# Altium schematic sheet USB-ESP32.SchDoc
size B
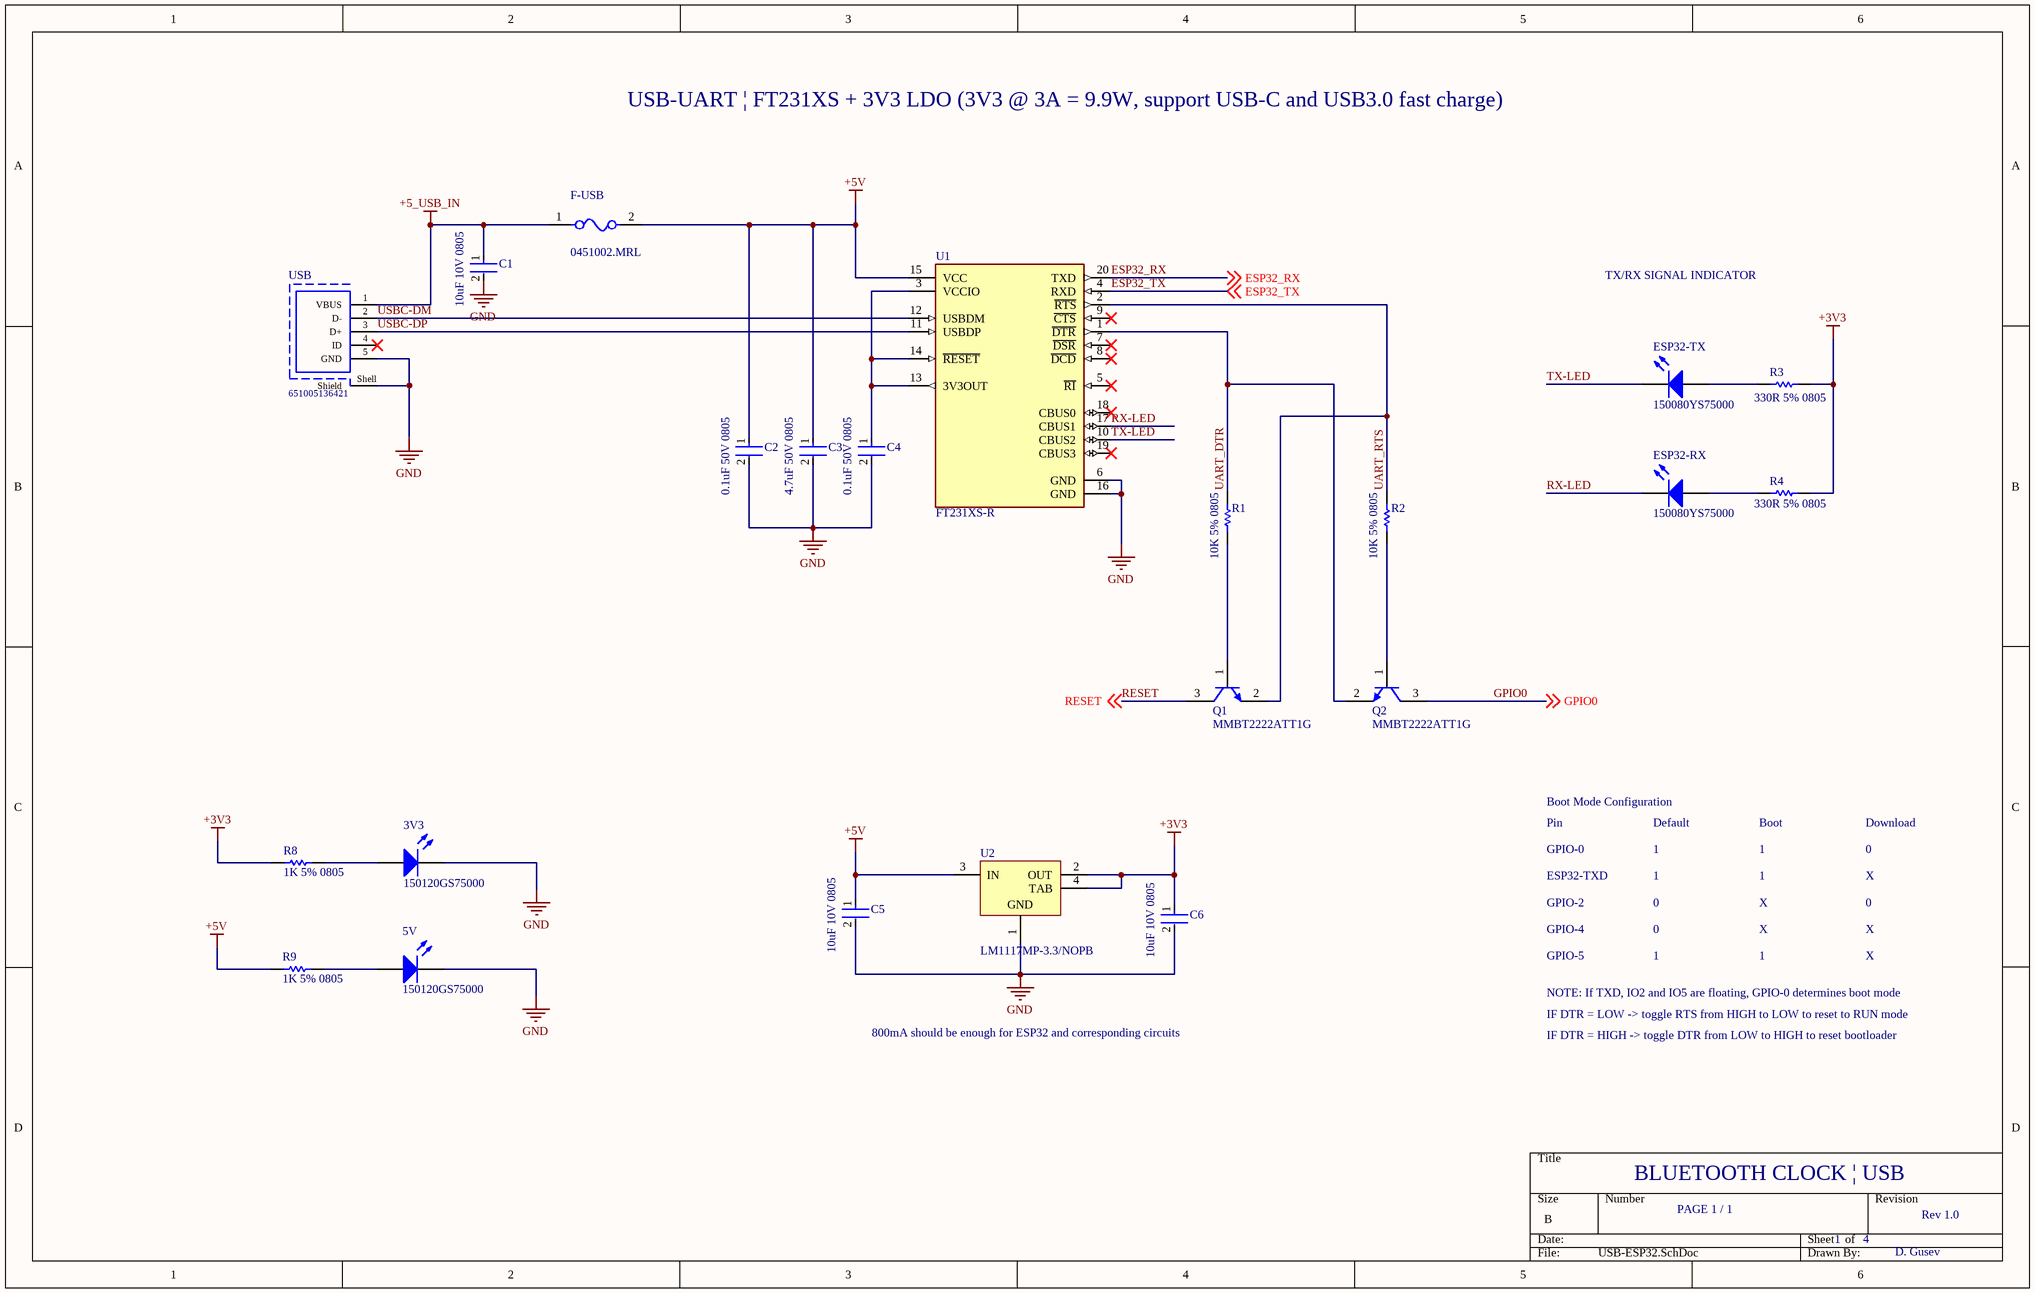
[diagram p0: USB-ESP32.SchDoc]

## Parts
3V3  150120GS75000  [1206_A]
5V  150120GS75000  [1206_A]
C1  10uF 10V 0805  [FP-C0805C-DG-MFG]
C2  0.1uF 50V 0805  [FP-C0805C-DN-MFG]
C3  4.7uF 50V 0805  [FP-C2012-125-MFG]
C4  0.1uF 50V 0805  [FP-C0805C-DN-MFG]
C5  10uF 10V 0805  [FP-C0805C-DG-MFG]
C6  10uF 10V 0805  [FP-C0805C-DG-MFG]
ESP32-RX  150080YS75000  [0805_A]
ESP32-TX  150080YS75000  [0805_A]
F-USB  0451002.MRL  [FP-0451-MFG]
Q1  MMBT2222ATT1G  [ONSC-SC-75-3-463-01_V]
Q2  MMBT2222ATT1G  [ONSC-SC-75-3-463-01_V]
R1  10K 5% 0805  [RESC2013X60X40ML20T25]
R2  10K 5% 0805  [RESC2013X60X40ML20T25]
R3  330R 5% 0805  [RESC2013X60X40ML20T25]
R4  330R 5% 0805  [RESC2013X60X40ML20T25]
R8  1K 5% 0805  [RESC2013X60X40ML20T25]
R9  1K 5% 0805  [RESC2013X60X40ML20T25]
U1  FT231XS-R  [FP-SSOP-20-MFG]
U2  LM1117MP-3.3/NOPB  [DCY0004A_L]
USB  651005136421  [651005136421]

## Nets
+3V3: C6.1 R3.1 R4.1 R8.2 U2.2(OUT) U2.4(TAB)
+5_USB_IN: C1.1 F-USB.1 USB.1(VBUS)
+5V: C2.1 C3.1 C5.1 F-USB.2 R9.2 U1.15(VCC) U2.3(IN)
GND: 3V3.1(K) 5V.1(K) C1.2 C2.2 C3.2 C4.2 C5.2 C6.2 U1.6(GND) U1.16(GND) U2.1(GND) USB.5(GND) USB.Shell(Shield)
ESP32_RX: U1.20(TXD) ; off-sheet ESP32_RX
ESP32_TX: U1.4(RXD) ; off-sheet ESP32_TX
GPIO0: Q2.3(C) ; off-sheet GPIO0
RESET: Q1.3(C) ; off-sheet RESET
RX-LED: ESP32-RX.1(K) U1.17(CBUS1)
TX-LED: ESP32-TX.1(K) U1.10(CBUS2)
UART_DTR: Q2.2(E) R1.2 U1.1(~{DTR})
UART_RTS: Q1.2(E) R2.2 U1.2(~{RTS})
USBC-DM: U1.12(USBDM) USB.2(D-)
USBC-DP: U1.11(USBDP) USB.3(D+)
Net3V3_2: 3V3.2(A) R8.1
Net5V_2: 5V.2(A) R9.1
NetC4_1: C4.1 U1.3(VCCIO) U1.13(3V3OUT) U1.14(~{RESET})
NetESP32-RX_2: ESP32-RX.2(A) R4.2
NetESP32-TX_2: ESP32-TX.2(A) R3.2
NetQ1_1: Q1.1(B) R1.1
NetQ2_1: Q2.1(B) R2.1

Not connected (* = marked no-connect by the designer): U1 5(~{RI})* 7(~{DSR})* 8(~{DCD})* 9(~{CTS})* 18(CBUS0)* 19(CBUS3)*; USB 4(ID)*

## Notes on the sheet
- USB-UART | FT231XS + 3V3 LDO (3V3 @ 3A = 9.9W, support USB-C and USB3.0 fast charge)
- TX/RX SIGNAL INDICATOR
- Boot Mode Configuration
- Pin
- Default
- Boot
- Download
- GPIO-0
- ESP32-TXD
- GPIO-2
- 1
- 0
- X
- GPIO-4
- GPIO-5
- 800mA should be enough for ESP32 and corresponding circuits
- NOTE: If TXD, IO2 and IO5 are floating, GPIO-0 determines boot mode
- IF DTR = LOW -> toggle RTS from HIGH to LOW to reset to RUN mode
- IF DTR = HIGH -> toggle DTR from LOW to HIGH to reset bootloader
- BLUETOOTH CLOCK | USB
- PAGE 1 / 1
- 4
- Rev 1.0
- D. Gusev

## Library data of the parts
3V3 5V = CMP-1426-00014-1: SMD mono-color Chip LED, WL-SMCW, Green; Manufacturer: Wuerth Elektronik; PackageReference: 1206_A; PartNumber: 150120GS75000; ComponentLink1Description: Manufacturer URL; ComponentLink2URL: http://katalog.we-online.com/led/datasheet/150120GS75000.pdf; ComponentLink2Description: Datasheet; Color: Green; ComponentLink1URL: http://www.we-online.com
C1 C5 C6 = CMP-2007-03243-2: CAP CER 10UF 10V X5R 0805; Manufacturer Part Number: C0805C106K8PACTU; Manufacturer: Kemet; 3DS Part Number: 220-00001; Tolerance: 10%; Temperature Coefficient: 15%; Material: Ceramic; Device Class L2: Capacitors; Device Class L1: Passive Components; ComponentLink2URL: https://content.kemet.com/datasheets/KEM_C1006_X5R_SMD.pdf; Height: 1.4mm; Lead Free: Yes; Digikey Description: CAP CER 10UF 10V X5R 0805; Octopart: https://octopart.com/c0805c106k8pactu-kemet-98697; Capacitance: 10uF; Value: 10uF; Temperature Range Low: -55°C; Temperature: -55°C to +85°C; Automotive: No; Mouser Description: CAP CER 10UF 10V X5R 0805; Ipc Land Pattern Name: CAPC200125X125; Temperature Range High: +85°C; Voltage: 10V; RoHS: TRUE; Device Class L3: Ceramic Capacitors; ComponentLink2Description: Datasheet; Voltage Rating: 10V; Package: C0805C-DG; Temperature Characteristic: X5R; Category: Cap
C2 C4 = CMP-2007-00279-2: CAP CER 0.1UF 50V X7R 0805; Manufacturer Part Number: C0805C104K5RACTU; Manufacturer: KEMET; Value: 0.10 μF; Tolerance: 0.1; Temperature Coefficient: 30ppm/°C; Material: Ceramic; Device Class L2: Capacitors; Temperature Range Low: -55°C; Voltage Rating: 50 V; Digikey Description: CAP CER 0.1UF 50V X7R 0805; Category: Cap; ComponentLink2Description: Datasheet; Octopart: https://octopart.com/c0805c104k5ractu-kemet-143926; RoHS: TRUE; ComponentLink2URL: https://content.kemet.com/datasheets/KEM_C1003_C0G_SMD.pdf; Temperature Characteristic: X7R; Temperature: -55°C to +125°C; Height: 0.88mm; Temperature Range High: +125°C; Device Class L1: Passive Components; Automotive: No; Lead Free: Yes; Ipc Land Pattern Name: CAPC200125X78; Device Class L3: Ceramic Capacitors; Mouser Description: Cap Ceramic 0.1uF 50V X7R 10% SMD 2.0 x 1.2 mm 125 C Paper T/R; Capacitance: 0.10 μF; Package: C0805C-DN
C3 = CMP-08246-000007-1: CAP CER 4.7UF 50V X5R 0805; Manufacturer Part Number: C2012X5R1H475K125AB; Manufacturer: TDK Corporation; Tolerance: 10%; Temperature Coefficient: 15%; Material: Ceramic; Mouser Description: Multilayer Ceramic Capacitors MLCC - SMD/SMT 0805 4.7uF 50volts X5R 10%; Category: Cap; Temperature Range High: +85°C; Digikey Description: CAP CER 4.7UF 50V X5R 0805; Voltage Rating: 50V; Device Class L1: Passive Components; Temperature Range Low: -55°C; Lead Free: Yes; ComponentLink2Description: Datasheet; Capacitance: 4.7uF; Octopart: https://octopart.com/c2012x5r1h475k125ab-tdk-25947720; Device Class L2: Capacitors; Value: 4.7uF; Temperature: -55°C to +85°C; ComponentLink2URL: https://product.tdk.com/info/en/catalog/datasheets/mlcc_commercial_general_en.pdf; RoHS: TRUE; Height: 1.45mm; Temperature Characteristic: X5R; Package: C2012-125; Device Class L3: Ceramic Capacitors; Automotive: No
ESP32-RX ESP32-TX = CMP-1426-00012-1: SMD mono-color Chip LED, WL-SMCW, Yellow; Manufacturer: Wuerth Elektronik; Color: Yellow; ComponentLink1URL: http://www.we-online.com; PackageReference: 0805_A; ComponentLink2URL: http://katalog.we-online.com/led/datasheet/150080YS75000.pdf; ComponentLink1Description: Manufacturer URL; ComponentLink2Description: Datasheet; PartNumber: 150080YS75000
F-USB = CMP-08605-000053-1: FUSE BOARD MNT 2A 125VAC/VDC SMD; Manufacturer: Littelfuse; Max Fuse Dc Voltage: 125V; Value: 0.0367Ω; Fuse Interrupt Ac Current: 50A; Fuse I2T: 0.53A2Sec; Fuse Blow Speed: Fast; Device Class L2: Fuses; Temperature Range High: +125°C; Category: Fuse; ComponentLink2URL: https://www.littelfuse.com/~/media/electronics/datasheets/fuses/littelfuse_fuse_451_453_datasheet.pdf.pdf; Automotive: No; Temperature Range Low: -55°C; Voltage Rating: 125V; ComponentLink2Description: Datasheet; Temperature: -55°C to +125°C; Device Class L3: unset; Height: 2.94mm; Lead Free: Yes; Resistance: 0.0367Ω; Max Fuse Ac Voltage: 125V; Fuse Interrupt Dc Current: 50A; RoHS: TRUE; Fuse Current: 2A; Digikey Description: FUSE BOARD MNT 2A 125VAC/VDC SMD; Device Class L1: Circuit Protection; Octopart: https://octopart.com/0451002.mrl-littelfuse-566376; Mouser Description: Surface Mount Fuses 125V 2A; Package: 0451; Manufacturer Part Number: 0451002.MRL
Q1 Q2 = CMP-1048-00417-1: General Purpose Transistor, NPN Silicon, 3-Pin SC-75, Pb-Free, Tape and Reel; Manufacturer: On Semiconductor; IC Continuous (A): 0.6; fT Min (MHz): 300; DatasheetVersion: Rev. 5; PackageVersion: Rev. F, 07/2005; ComponentLink1Description: Manufacturer URL; RoHS: TRUE; Packing: Tape and Reel; ComponentLink3URL: http://www.onsemi.com/pub_link/Collateral/463-01.PDF; ComponentLink1URL: http://www.onsemi.com/; ComponentLink3Description: Package Specification; ComponentLink2URL: http://www.onsemi.cn/pub_link/Collateral/MMBT2222ATT1-D.PDF; Mounting Technology: Surface Mount; PartNumber: MMBT2222ATT1G; ComponentLink2Description: Datasheet; Polarity: NPN; PackageReference: SC-75-3-463-01; PackageDescription: 3-Pin Small Outline Transistor, Body 1.6 x 0.8 mm, Pitch 0.5 mm
R1-R4 R8 R9 = CMP-2001-00590-1: Part Number: ERA6AEB123V; Manufacturer: Panasonic
U1 = CMP-0248-00024-3: IC USB SERIAL FULL UART 20SSOP; Operating Supply Voltage: 5V; Operating Supply Current: 8mA; Number of Channels: 1; Min Supply Voltage: 2.97V; Max Supply Voltage: 5.5V; Data Rate: 12Mbps; Height: 0.059inch; Packaging: Tape and Reel; Mount: Surface Mount; Package Quantity: 2000; Radiation Hardening: No; Case/Package: SSOP; Min Operating Temperature: -40°C; Width: 0.157inch; Number of Pins: 20; Weight: 0.016oz; Interface: UART; Max Operating Temperature: 85°C; Length: 8.74mm
U2 = CMP-0062-01638-4: 800mA Low-Dropout Linear Regulator, 4-pin SOT-223, Pb-Free; Manufacturer: Texas Instruments; CompType: LDO IC; PackageTopMarking: XYTT*N05A; High-Reliability: Y; PowerWise: N; ComponentLink1URL: http://www.ti.com/general/docs/lit/getliterature.tsp?genericPartNumber=LM1117-N&fileType=pdf; PinCount: 4; PackageDescription: Molded SOT-223, 6.50 x 3.56 x 1.6mm Body, 4 Lead, 2.3mm Pitch; Code_IPC: SOT223-4; PartNumber: LM1117MP-3.3/NOPB; Code_JEDEC: TO-261-AA; RoHS: Y; PackageReference: DCY0004A; ComponentLink1Description: Datasheet URL
USB = CMP-1502-03248-1: Mini USB 2.0 Type B Receptacle WR-COM, Vertical, THT; Manufacturer: Wurth Elektronik; Rated Current: 1A; Working Voltage: 30VAC; Contact Resistance: 20mOhm; Gender: Receptacle; Part Number: 651005136421; Package Reference: 651005136421; Datasheet URL: https://katalog.we-online.de/em/datasheet/651005136421%282%29.pdf; Publisher: WurthElektronik; Operating Temperature: -40to105degC; Connector Type: MiniUSB2.0TypeB; Packaging: Tray; Mounting Technology: THT; Manufacturer URL: http://www.we-online.de; Orientation: Vertical